# EAGLE schematic GSM (EAGLE 7.4.0)
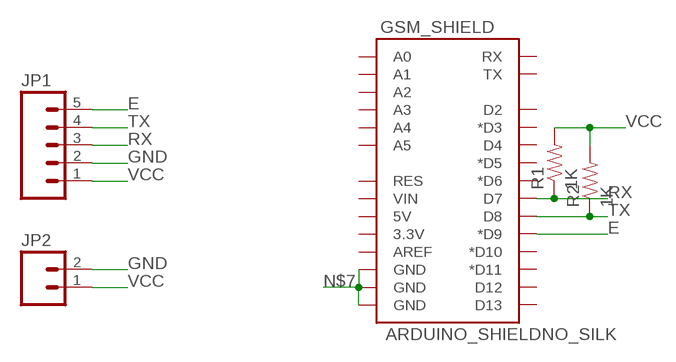
[diagram p0: schematic, sheet 1]

## Parts
GSM_SHIELD  ARDUINO_SHIELDNO_SILK  [DUEMILANOVE_VIAS]
JP1  M05PTH_LONGPADS  [1X05_LONGPADS]
JP2  M02PTH3  [1X02_LONGPADS]
R1  1K  RESISTORPTH-1/4W  [AXIAL-0.4]
R2  1K  RESISTORPTH-1/4W  [AXIAL-0.4]

## Nets
E: GSM_SHIELD.D9(*D9) JP1.5
GND: JP1.2 JP2.2
N$7: GSM_SHIELD.GND@0(GND) GSM_SHIELD.GND@1(GND) GSM_SHIELD.GND@2(GND)
RX: GSM_SHIELD.D7 JP1.3 R1.P$1
TX: GSM_SHIELD.D8 JP1.4 R2.P$1
VCC: JP1.1 JP2.1 R1.P$2 R2.P$2
Unconnected: GSM_SHIELD.3.3V GSM_SHIELD.5V GSM_SHIELD.A0 GSM_SHIELD.A1 GSM_SHIELD.A2 GSM_SHIELD.A3 GSM_SHIELD.A4 GSM_SHIELD.A5 GSM_SHIELD.AREF GSM_SHIELD.D2 GSM_SHIELD.D3(*D3) GSM_SHIELD.D4 GSM_SHIELD.D5(*D5) GSM_SHIELD.D6(*D6) GSM_SHIELD.D10(*D10) GSM_SHIELD.D11(*D11) GSM_SHIELD.D12 GSM_SHIELD.D13 GSM_SHIELD.RES GSM_SHIELD.RX GSM_SHIELD.TX GSM_SHIELD.VIN

## Library data of the parts
GSM_SHIELD = SparkFun-Boards:ARDUINO_SHIELD: Arduino shield footprint
JP1 = SparkFun:M05: Header 5 Standard 5-pin 0.1" header. Use with straight break away headers (SKU : PRT-00116), right angle break away headers (PRT-00553), swiss pins (PRT-00743), machine pins (PRT-00117), and female headers (PRT-00115). Molex polarized connector foot print use with SKU : PRT-08230 with associated crimp pins and housings.
JP2 = SparkFun:M02: Header 2 Standard 2-pin 0.1" header. Use with straight break away headers (SKU : PRT-00116), right angle break away headers (PRT-00553), swiss pins (PRT-00743), machine pins (PRT-00117), and female headers (PRT-00115). Molex polarized connector foot print use with SKU : PRT-08233 with associated crimp pins and housings.
R1 R2 = SparkFun:RESISTOR: Resistor Basic schematic elements and footprints for 0603, 1206, and PTH resistors.